# EAGLE design air_qual_mqtt (EAGLE 9.7.0)
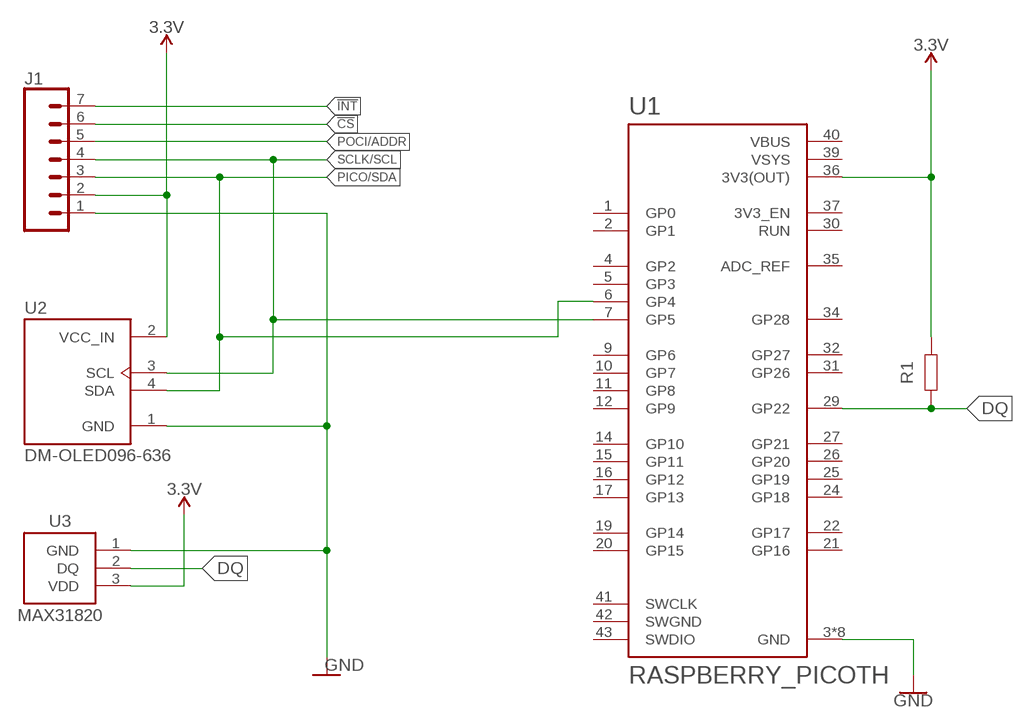
[diagram p0: schematic, sheet 1]

## Parts
J1  CONN_07NO_SILK  [1X07_NO_SILK]
R1  R_AXIAL-11.7MM-PITCH  [RESAD1176W63L850D250B]
U1  RASPBERRY_PICOTH  [PICO-PKG-TH]
U2  DM-OLED096-636  [MODULE_DM-OLED096-636]
U3  MAX31820  [TO92]

## Nets
3.3V: J1.2 R1.2 U1.36(3V3(OUT)) U2.2(VCC_IN) U3.3(VDD)
!CS!: J1.6
!INT!: J1.7
DQ: R1.1 U1.29(GP22) U3.2(DQ)
GND: J1.1 U1.3(GND) U1.8(GND) U1.13(GND) U1.18(GND) U1.23(GND) U1.28(GND) U1.33(GND) U1.38(GND) U2.1(GND) U3.1(GND)
PICO/SDA: J1.3 U1.6(GP4) U2.4(SDA)
POCI/ADDR: J1.5
SCLK/SCL: J1.4 U1.7(GP5) U2.3(SCL)
Unconnected: U1.1(GP0) U1.2(GP1) U1.4(GP2) U1.5(GP3) U1.9(GP6) U1.10(GP7) U1.11(GP8) U1.12(GP9) U1.14(GP10) U1.15(GP11) U1.16(GP12) U1.17(GP13) U1.19(GP14) U1.20(GP15) U1.21(GP16) U1.22(GP17) U1.24(GP18) U1.25(GP19) U1.26(GP20) U1.27(GP21) U1.30(RUN) U1.31(GP26) U1.32(GP27) U1.34(GP28) U1.35(ADC_REF) U1.37(3V3_EN) U1.41(SWCLK) U1.43(SWDIO)

## Power pins joined to a net without a drawn wire
SWGND: U1.42(SWGND)
VBUS: U1.40(VBUS)
VSYS: U1.39(VSYS)

## Library data of the parts
J1 = SparkFun-Connectors:CONN_07: Multi connection point. Often used as Generic Header-pin footprint for 0.1 inch spaced/style header connections On any of the 0.1 inch spaced packages, you can populate with these: Break Away Headers - Straight <https://www.sparkfun.com/products/116> (PRT-00116) Break Away Male Headers - Right Angle <https://www.sparkfun.com/products/553> (PRT-00553) Female Headers <https://www.sparkfun.com/products/115> (PRT-00115) Break Away Headers - Machine Pin <https://www.sparkfun.com/products/117> (PRT-00117) Break Away Female Headers - Swiss Machine Pin <https://www.sparkfun.com/products/743> (PRT-00743) For SCREWTERMINALS and SPRING TERMINALS visit here: Screw Terimnals on SparkFun.com <https://www.sparkfun.com/search/results?term=Screw+Terminals> (5mm/3.5mm/2.54mm spacing) This device is also useful as a general connection point to wire up your design to another part of your project. Our various solder wires solder well into these plated through hole pads. Hook-Up Wire - Assortment (Stranded, 22 AWG) <https://www.sparkfun.com/products/11375> (PRT-11375) Hook-Up Wire - Assortment (Solid Core, 22 AWG) <https://www.sparkfun.com/products/11367> (PRT-11367) View the entire wire category on our website here <https://www.sparkfun.com/categories/141> Special notes: Molex polarized connector foot print use with SKU : PRT-08231 with associated crimp pins and housings. 1MM SMD Version SKU: PRT-10208 NOTES ON THE VARIANTS LOCK and LOCK_LONGPADS... This footprint was designed to help hold the alignment of a through-hole component (i.e. 6-pin header) while soldering it into place. You may notice that each hole has been shifted either up or down by 0.005 of an inch from it's more standard position (which is a perfectly straight line). This slight alteration caused the pins (the squares in the middle) to touch the edges of the holes. Because they are alternating, it causes a "brace" to hold the component in place. 0.005 has proven to be the perfect amount of "off-center" position when using our standard breakaway headers. Although looks a little odd when you look at the bare footprint, once you have a header in there, the alteration is very hard to notice. Also,if you push a header all the way into place, it is covered up entirely on the bottom side.
R1 = Resistor:R: Resistor Fixed - Generic; CATEGORY: Resistors; DESCRIPTION: Axial Resistor 11.76 mm pitch 8.5 mm body length 2.5 mm body diameter; PACKAGE_SIZE: AXIAL; PACKAGE_TYPE: THT
U1 = RpiPico:RASPBERRY_PICO: Raspberry Pi Pico
U2 = DM-OLED096-636:DM-OLED096-636: Check availability <https://pricing.snapeda.com/parts/DM-OLED096-636/Display%20Module/view-part?ref=eda>; AVAILABILITY: Not in stock; CHECK_PRICES: https://www.snapeda.com/parts/DM-OLED096-636/Display+Module/view-part/?ref=eda; DESCRIPTION: 0.96” 128 X 64 MONOCHROME GRAPHIC OLED DISPLAY MODULE - I2C; MF: Display Module; MP: DM-OLED096-636; PACKAGE: Package; PRICE: None; SNAPEDA_LINK: https://www.snapeda.com/parts/DM-OLED096-636/Display+Module/view-part/?ref=snap
U3 = Library:MAX31820: MAX31820 1-Wire Ambient Temperature Sensor. Software compatible with the DS1822 and DS18B20

## Board
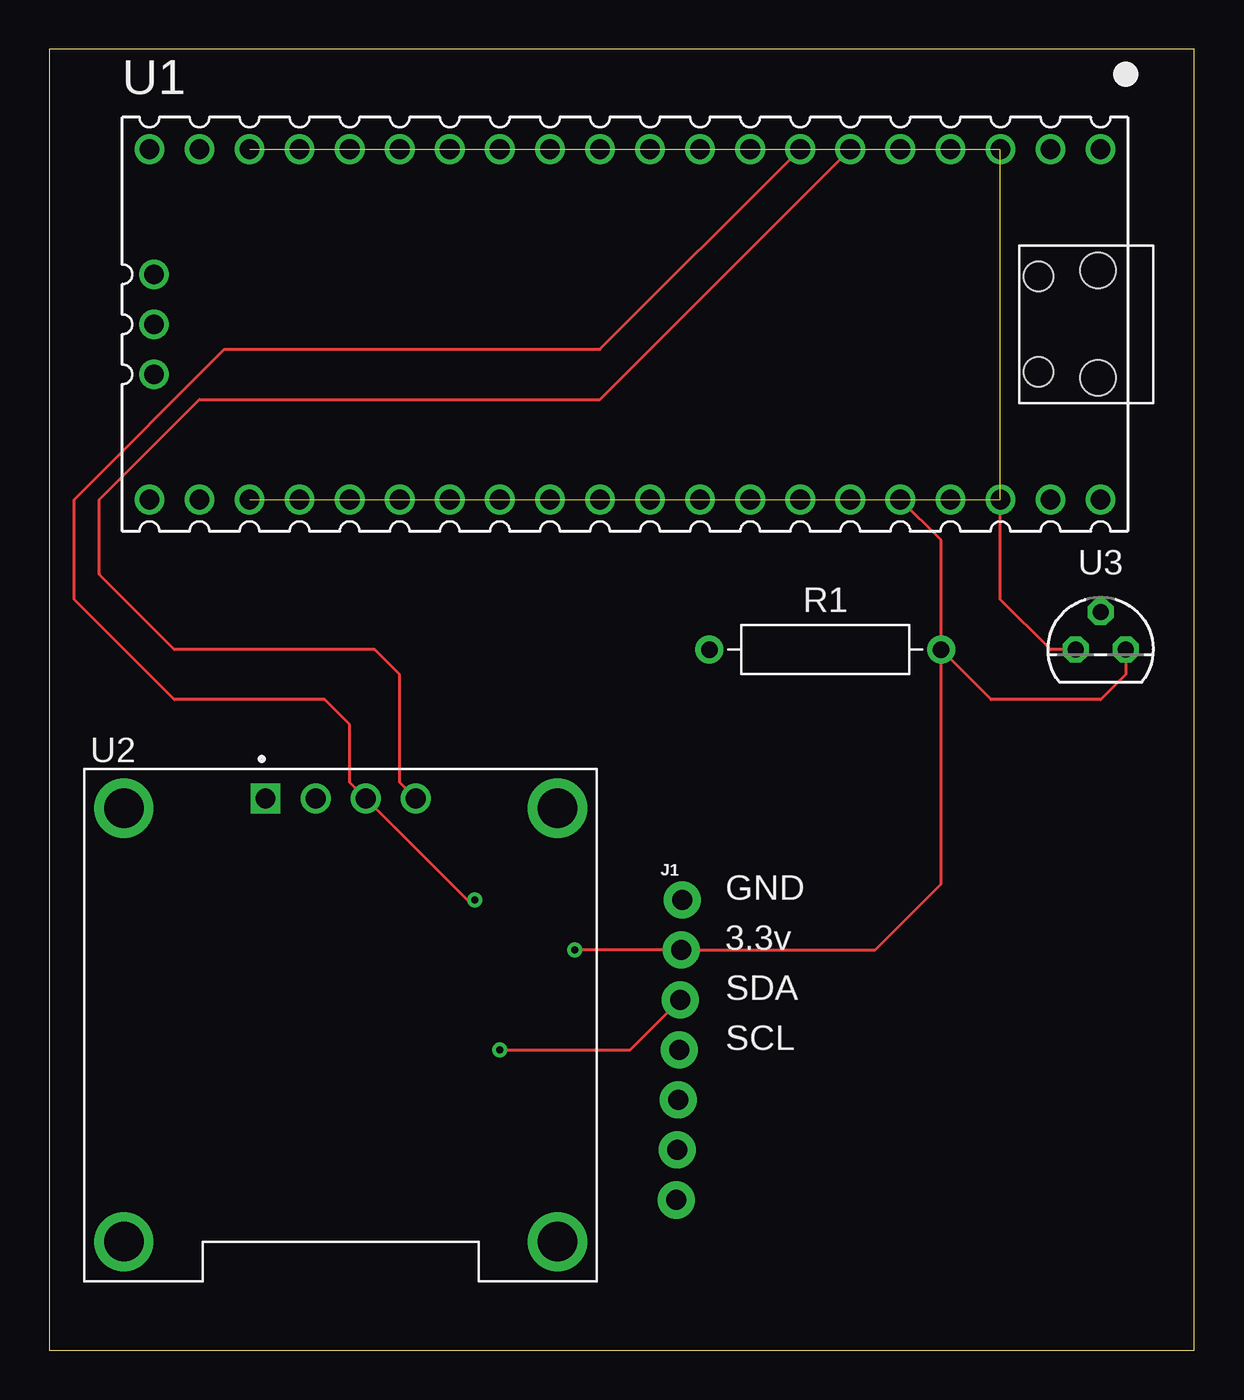
[diagram p1: board, top side]
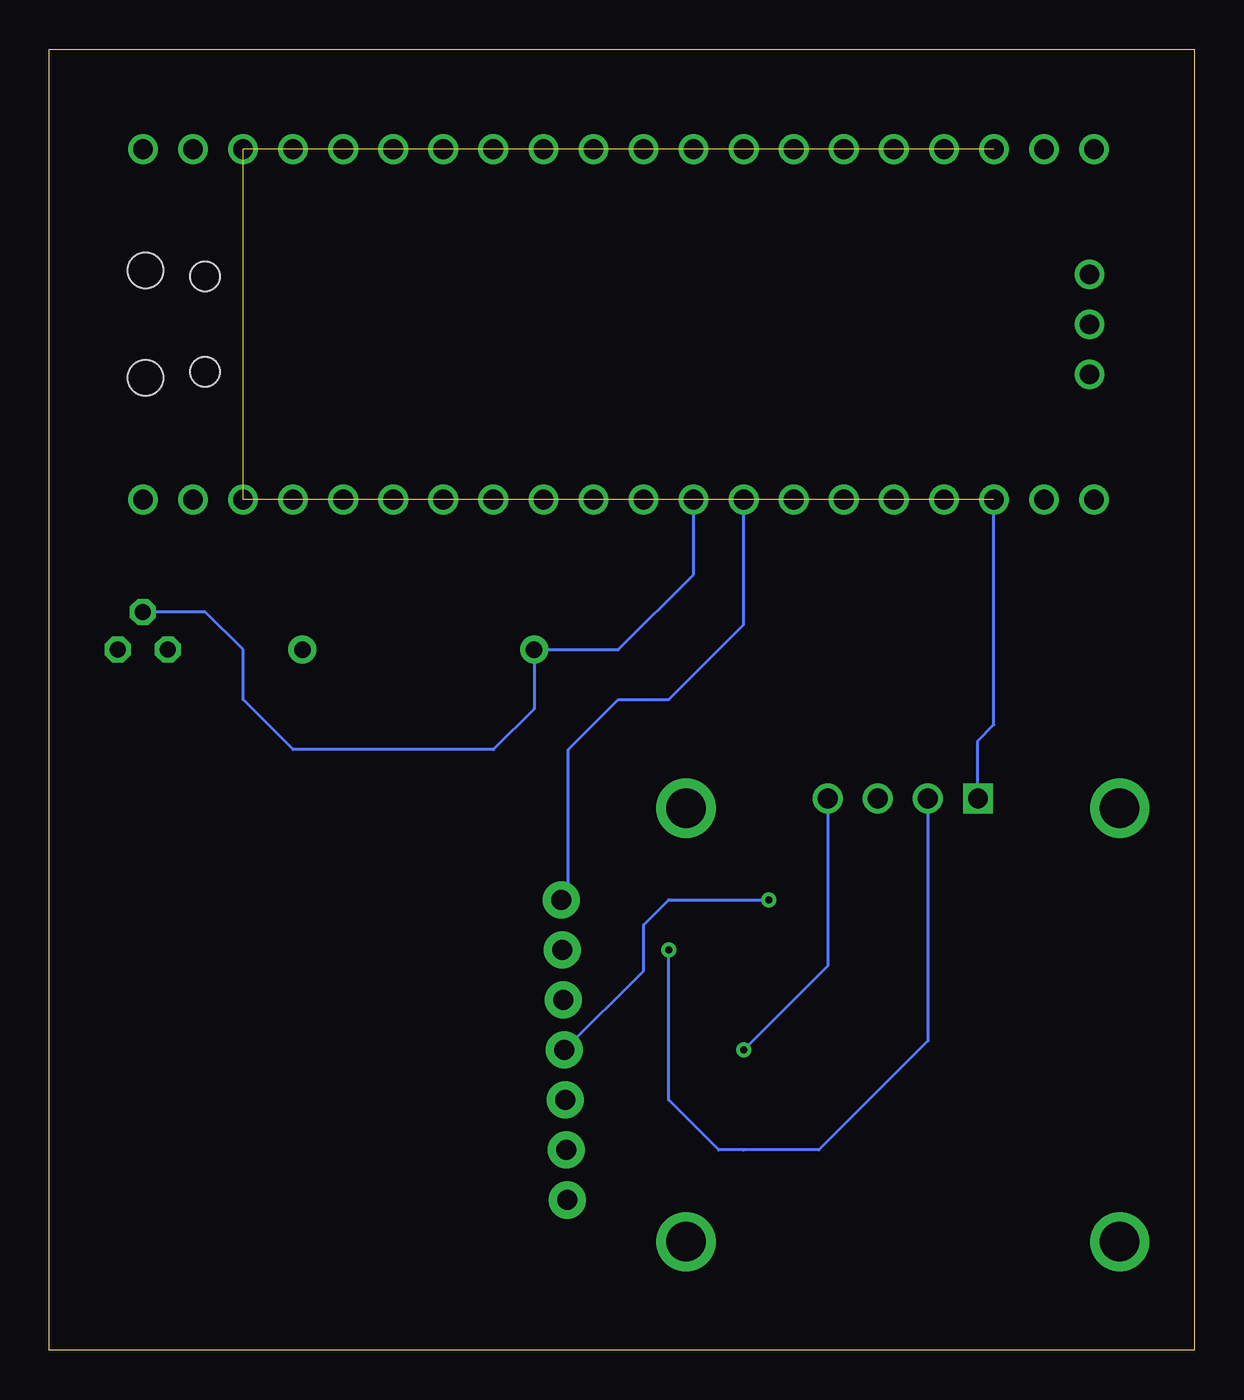
[diagram p2: board, bottom side, seen from below]

Size 58.09 x 66.03 mm. Coordinates in mm from the lower left corner, seen from the top.
Outline: 0,0 58.09,0 58.09,66.03 0,66.03 0,0
Copper layers (1*16): Top 0.035mm / dielectric 1.5mm / Bottom 0.035mm
Design rules "Fusion Electronics Design Rules": minimum track width 6mil, minimum drill 0.35mm, track to track 6mil, track to pad 6mil, pad to pad 6mil, via to via 6mil, smd to smd 6mil, copper to edge 40mil, drill to drill 6mil, minimum pad ring 10mil, minimum via ring 8mil, stop-mask expansion 4mil, vias tented up to drill 9999mil, thermal gap 10mil

### Footprints (pad centres in the part's own frame; a part is rotated, then mirrored left to right if it is on the bottom)
1X07_NO_SILK = drill 1.016 pad 1.88: 1 0,0; 2 2.54,0; 3 5.08,0; 4 7.62,0; 5 10.16,0; 6 12.7,0; 7 15.24,0
RESAD1176W63L850D250B = drill 0.83 pad 1.43: 1 -5.88,0; 2 5.88,0
PICO-PKG-TH = drill 1: 1 -8.89,24.13; 2 -8.89,21.59; 3 -8.89,19.05; 4 -8.89,16.51; 5 -8.89,13.97; 6 -8.89,11.43; 7 -8.89,8.89; 8 -8.89,6.35; 9 -8.89,3.81; 10 -8.89,1.27; 11 -8.89,-1.27; 12 -8.89,-3.81; 13 -8.89,-6.35; 14 -8.89,-8.89; 15 -8.89,-11.43; 16 -8.89,-13.97; 17 -8.89,-16.51; 18 -8.89,-19.05; 19 -8.89,-21.59; 20 -8.89,-24.13; 21 8.89,-24.13; 22 8.89,-21.59; 23 8.89,-19.05; 24 8.89,-16.51; 25 8.89,-13.97; 26 8.89,-11.43; 27 8.89,-8.89; 28 8.89,-6.35; 29 8.89,-3.81; 30 8.89,-1.27; 31 8.89,1.27; 32 8.89,3.81; 33 8.89,6.35; 34 8.89,8.89; 35 8.89,11.43; 36 8.89,13.97; 37 8.89,16.51; 38 8.89,19.05; 39 8.89,21.59; 40 8.89,24.13; 41 -2.54,-23.9; 42 0,-23.9; 43 2.54,-23.9 | hole 1.8: -2.725,24; 2.725,24 | hole 1.5: -2.425,20.97; 2.425,20.97
MODULE_DM-OLED096-636 = drill 1 square: 1 -3.81,11.5 | drill 1: 2 -1.27,11.5; 3 1.27,11.5; 4 3.81,11.5 | drill 2: S1 -11,11; S2 11,11; S3 11,-11; S4 -11,-11
TO92 = drill 0.813 octagon: 1 -1.27,0; 2 0,1.905; 3 1.27,0

### Placement (x,y rotation side)
J1  32.11,22.86 268.9 top
R1  39.37,35.56 0 top
U1  29.21,52.07 270 top
U2  14.79,16.51 0 top
U3  53.34,35.56 0 top

### Tracks (layer width: path | path; a pad name or v marks a point on that pad's centre or on a via)
3.3V  (via drill 0.35)
  Top 0.152: R1.2 45.25,41.11 U1.36 | U3.3 54.61,34.29 53.34,33.02 47.79,33.02 R1.2 | J1.2 41.91,20.32 45.25,23.66 R1.2 | J1.2 | J1.2 v26.67,20.32
  Bottom 0.152: U2.2 13.52,15.69 19.05,10.16 22.86,10.16 | 22.86,10.16 | 22.86,10.16 24.13,10.16 26.67,12.7 v26.67,20.32
DQ
  Bottom 0.152: U3.2 50.16,37.47 48.26,35.56 48.26,33.02 45.72,30.48 35.56,30.48 33.49,32.55 R1.1 29.21,35.56 25.4,39.37 U1.29
GND  (7 unrouted)
  Top 0.152: U3.1 50.8,35.56 48.26,38.1 U1.38
  Bottom 0.152: U2.1 10.98,30.93 10.16,31.75 U1.23 | J1.1 31.75,23.22 31.75,30.48 29.21,33.02 26.67,33.02 22.86,36.83 U1.28
PICO/SDA  (via drill 0.35)
  Top 0.152: U2.4 17.78,28.83 17.78,34.29 16.51,35.56 6.35,35.56 2.54,39.37 2.54,43.18 7.62,48.26 27.94,48.26 U1.6 | v22.86,15.24 29.47,15.24 J1.3
  Bottom 0.152: v22.86,15.24 18.6,19.5 U2.4
SCLK/SCL  (via drill 0.35)
  Top 0.152: U1.7 27.94,50.8 8.89,50.8 1.27,43.18 1.27,38.1 6.35,33.02 13.97,33.02 15.24,31.75 15.24,28.83 U2.3 21.21,22.86 v21.59,22.86
  Bottom 0.152: J1.4 27.94,19.26 27.94,21.59 26.67,22.86 v21.59,22.86

### Text on the board
tPlace: GND | 3.3v | SDA | SCL
Measures: Units in Inches